# EAGLE design Grove-Barometer (High-Accuracy) v1.0 (EAGLE 6.4)
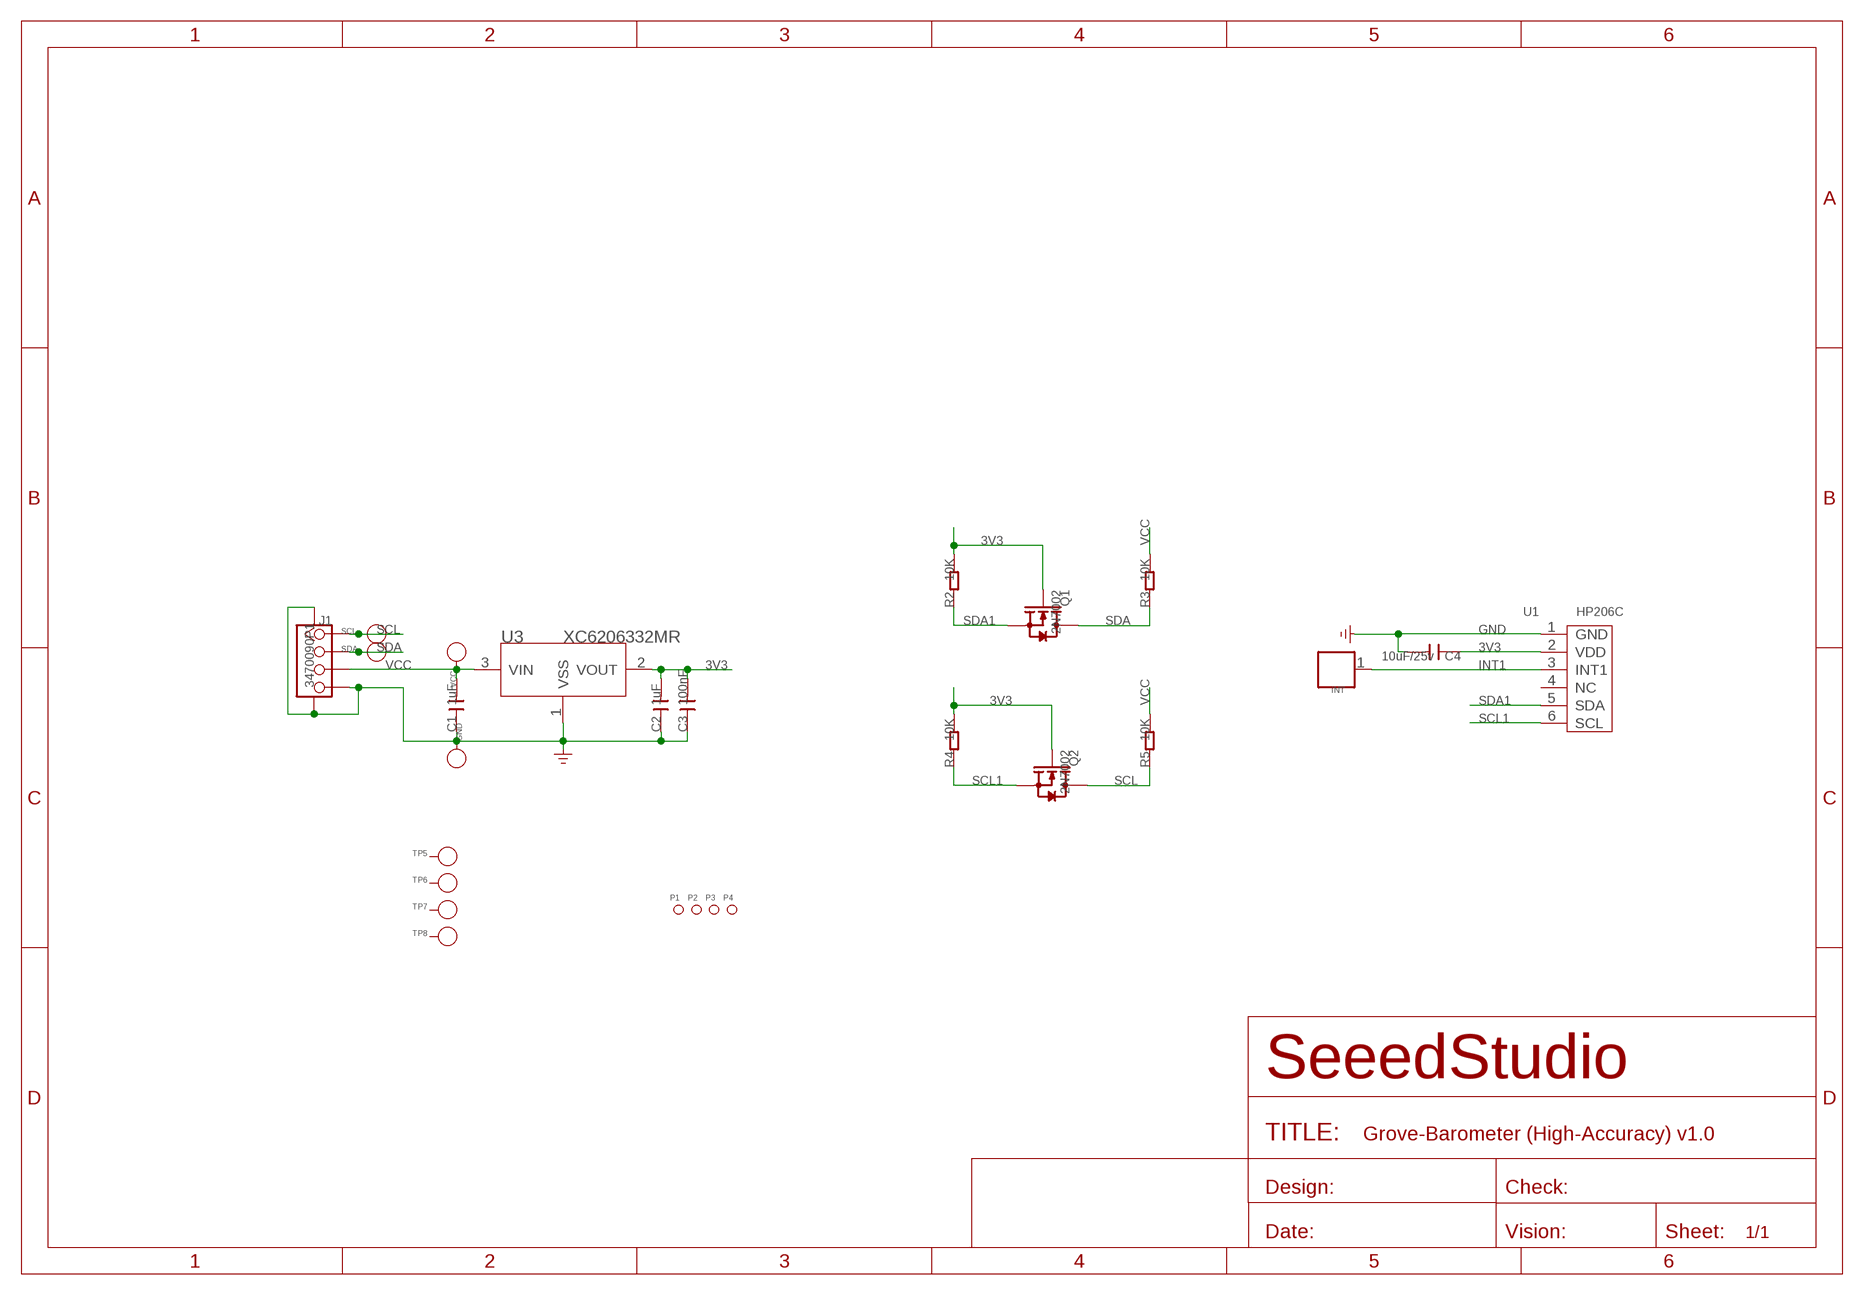
[diagram p0: schematic, sheet 1]

## Parts
C1  1uF  C-0603  [C0603]
C2  1uF  C-0603  [C0603]
C3  100nF  C-0603  [C0603]
C4  10uF/25v  C-0805  [C0805]
GND  PAD-TEST-POINT'4545'  [TP_4545]
INT  PAD'60/30'  [1P-65/35MIL]
J1  3470090P1  TWIG-4P-2.0-SMD-FEMALE-REINFORCE'DD'  [4P-SMD-2.0]
P1  PAD-MARK  [ROUND-MARK-1.0]
P2  PAD-MARK  [ROUND-MARK-1.0]
P3  PAD-MARK  [ROUND-MARK-1.0]
P4  PAD-MARK  [ROUND-MARK-1.0]
Q1  2N7002  MOSFET-N'SOT23'  [SOT23]
Q2  2N7002  MOSFET-N'SOT23'  [SOT23]
R2  10K  R-0603  [R0603]
R3  10K  R-0603  [R0603]
R4  10K  R-0603  [R0603]
R5  10K  R-0603  [R0603]
SCL  PAD-TEST-POINT'4545'  [TP_4545]
SDA  PAD-TEST-POINT'4545'  [TP_4545]
TP5  PAD-TEST-POINT'4545'  [TP_4545]
TP6  PAD-TEST-POINT'4545'  [TP_4545]
TP7  PAD-TEST-POINT'4545'  [TP_4545]
TP8  PAD-TEST-POINT'4545'  [TP_4545]
U1  HP206C  [6P-SMD-6.8X6.2]
U3  XC6206332MR  XC6206MR  [SOT23]
VCC  PAD-TEST-POINT'4545'  [TP_4545]

## Nets
3V3: C2.2 C3.2 C4.1 Q1.1(G) Q2.1(G) R2.2 R4.2 U1.2(VDD) U3.2(VOUT)
GND: C1.1 C2.1 C3.1 C4.2 GND.T J1.4 J1.SS1 J1.SS2 U1.1(GND) U3.1(VSS)
INT1: INT.1 U1.3(INT1)
SCL: J1.1 Q2.3(D) R5.1 SCL.T
SCL1: Q2.2(S) R4.1 U1.6(SCL)
SDA: J1.2 Q1.3(D) R3.1 SDA.T
SDA1: Q1.2(S) R2.1 U1.5(SDA)
VCC: C1.2 J1.3 R3.2 R5.2 U3.3(VIN) VCC.T
Unconnected: TP5.T TP6.T TP7.T TP8.T U1.4(NC)

## Library data of the parts
C1-C4 = Discrete:C*: Ceramic Capacitors
GND SCL SDA TP5-TP8 VCC = Discrete:PAD-TEST-POINT; PARTNO: DNP
INT = Discrete:PAD
J1 = Connector :TWIG-4P-2.0-SMD-FEMALE-REINFORCE
P1-P4 = Discrete:PAD-MARK; PARTNO: DNP
Q1 Q2 = Discrete:MOSFET-N: IRLL014: http://www.vishay.com/docs/91319/sihll014.pdf
R2-R5 = Discrete:R*
U1 = template :HP206C: I2C PRECISION BAROMETER AND ALTIMETER
U3 = IC:XC6206: LOW ESR Cap.Compatible Positive Voltage Regulators

## Board
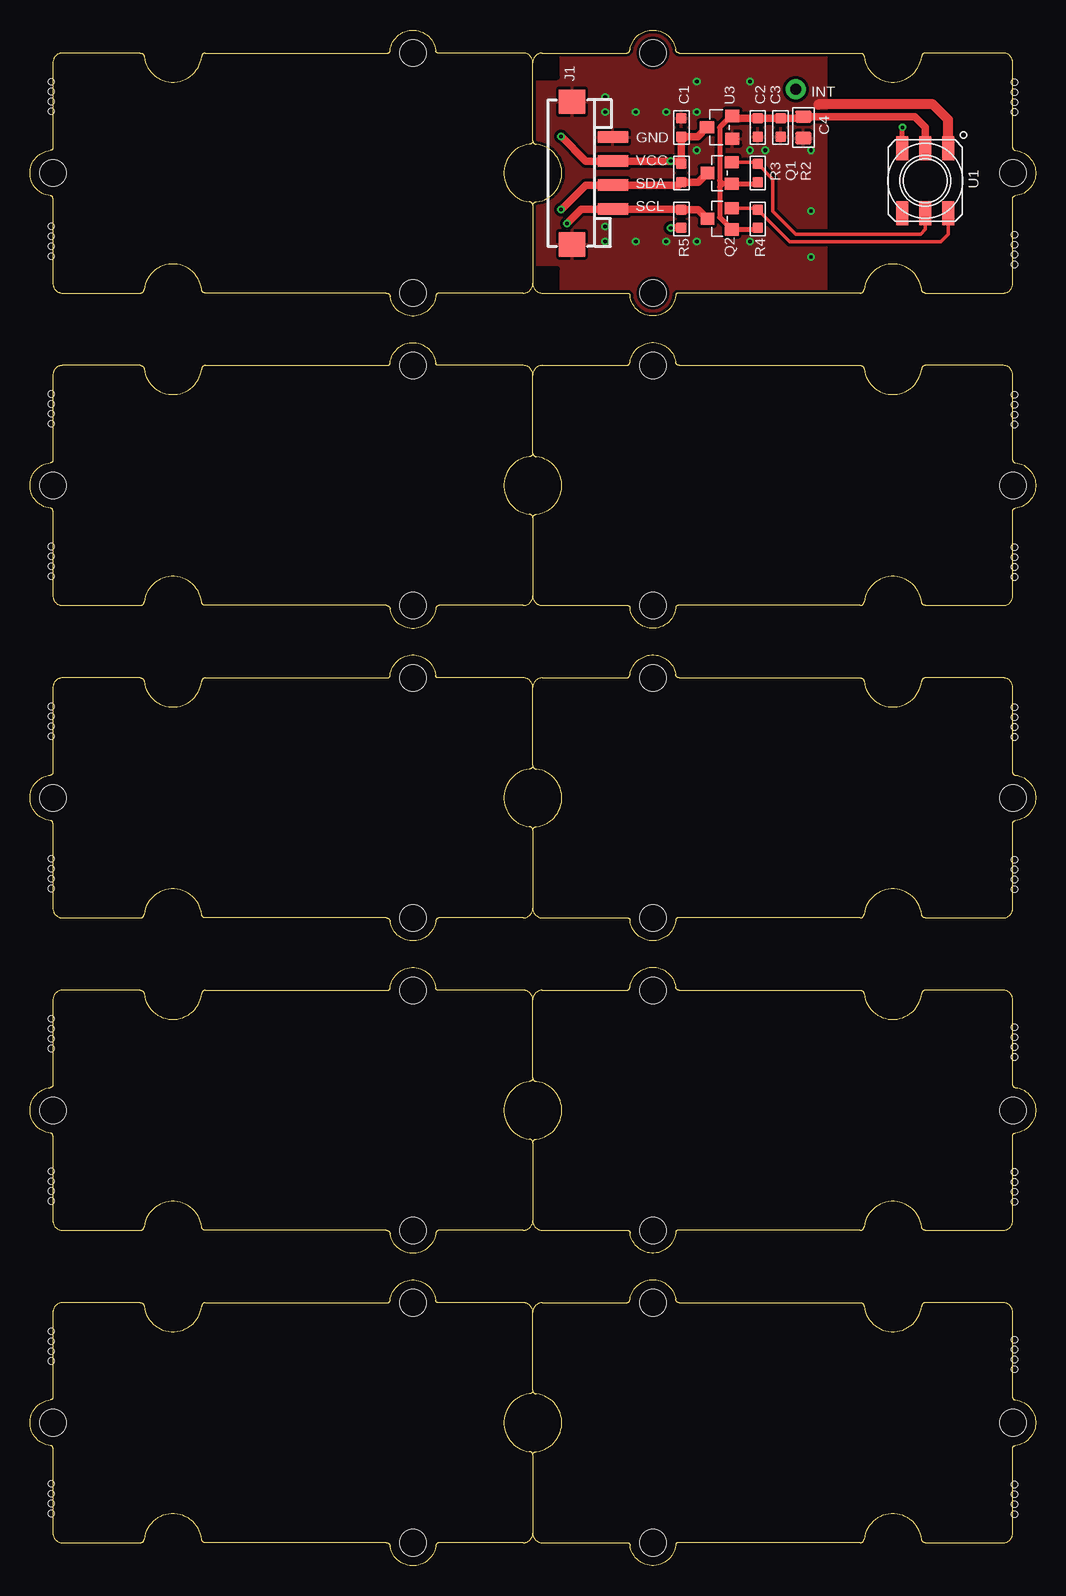
[diagram p1: board, top side]
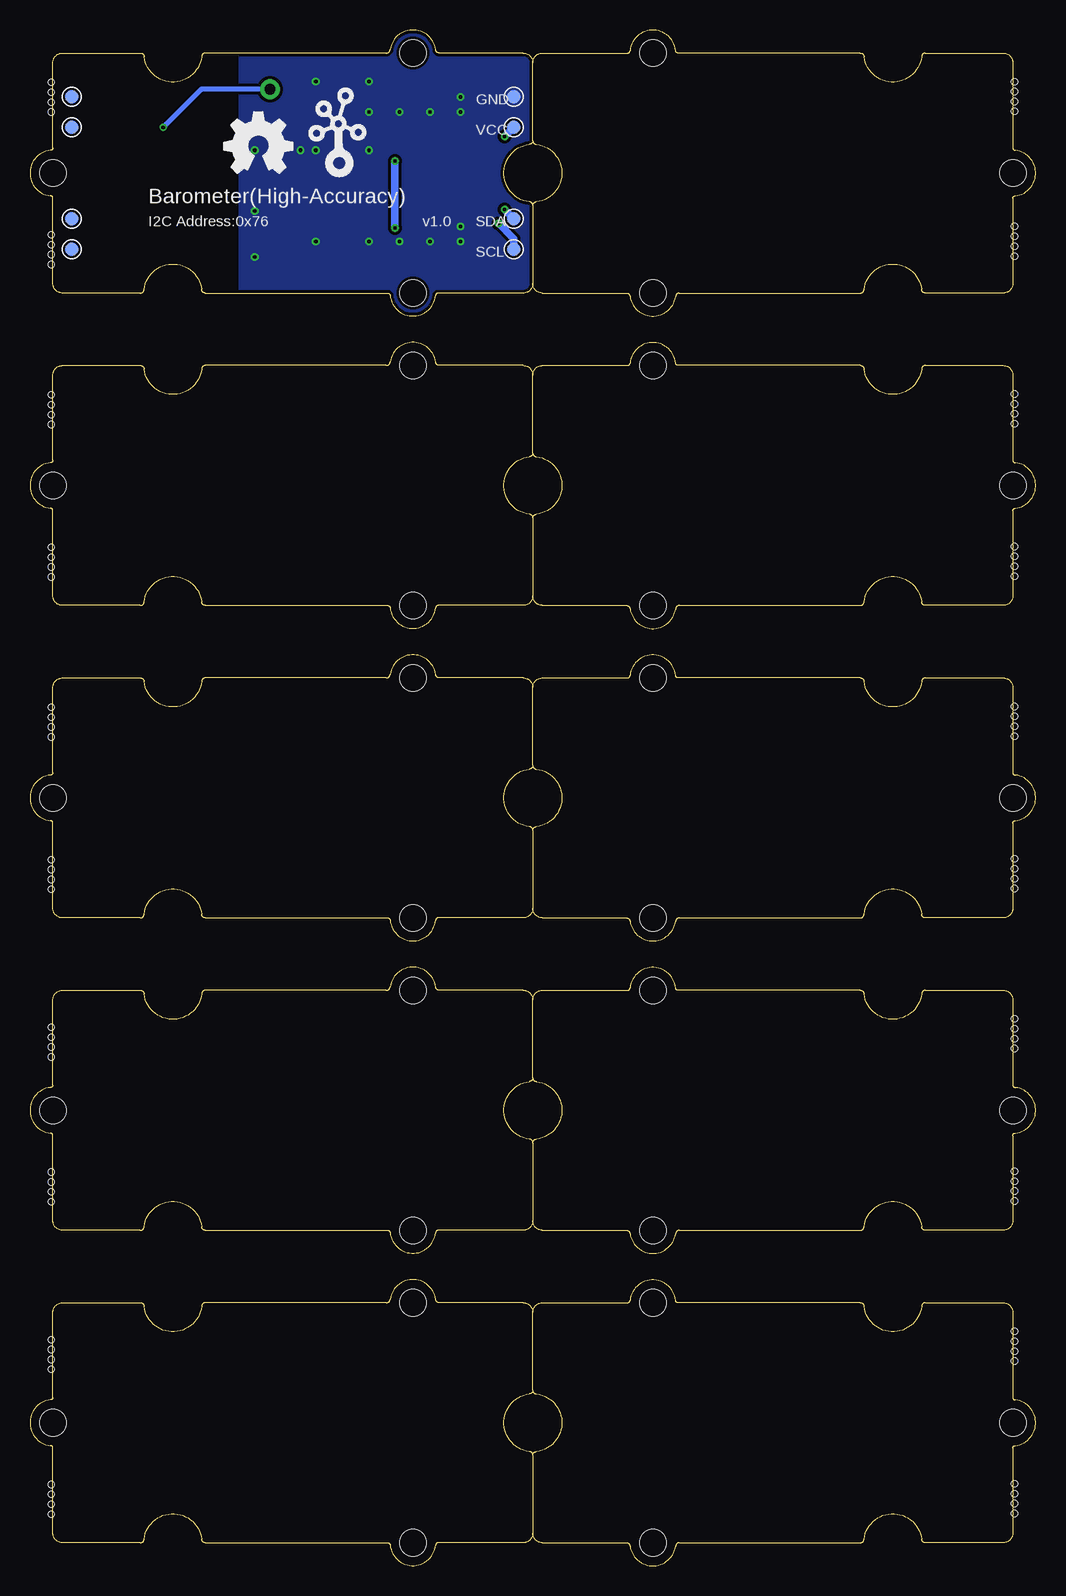
[diagram p2: board, bottom side, seen from below]

Size 83.81 x 127.98 mm. Coordinates in mm from the lower left corner, seen from the top.
Copper layers (1*16): Top 0.035mm / dielectric 1.5mm / Bottom 0.035mm
Design rules "SeeedStudio_2layer_DRU_no_angle_20140221 *": minimum track width 6mil, minimum drill 12mil, track to track 6mil, track to pad 6mil, pad to pad 6mil, via to via 6mil, smd to smd 0mil, copper to edge 10mil, drill to drill 10mil, minimum pad ring 10mil, minimum via ring 6mil, stop-mask expansion 2mil, vias tented up to drill 100mil, thermal gap 10mil
Holes 0.5 mm at 1.77,32.88 1.77,30.4 1.77,31.23 1.77,32.05 1.77,45.58 1.77,43.1 1.77,43.93 1.77,44.75 1.77,58.91 1.77,56.43 1.77,57.26 1.77,58.09 1.77,71.61 1.77,69.13 1.77,69.96 1.77,70.79 1.77,84.95 1.77,82.47 1.77,83.3 1.77,84.12 1.77,97.65 1.77,95.17 1.77,96 1.77,96.82 1.77,111.62 1.77,109.14 1.77,109.97 1.77,110.79 1.77,123.68 1.77,121.2 1.77,122.03 1.77,122.86 82.04,121.14 82.04,123.62 82.04,122.79 82.04,121.97 82.04,108.44 82.04,110.92 82.04,110.09 82.04,109.27 82.04,95.11 82.04,97.58 82.04,96.76 82.04,95.93 82.04,82.41 82.04,84.88 82.04,84.06 82.04,83.23 82.04,69.07 82.04,71.55 82.04,70.72 82.04,69.9 82.04,56.37 82.04,58.85 82.04,58.02 82.04,57.2 82.04,42.4 82.04,44.88 82.04,44.05 82.04,43.23 82.04,30.34 82.04,32.81 82.04,31.99 82.04,31.16 1.77,6.84 1.77,4.36 1.77,5.19 1.77,6.02 1.77,19.54 1.77,17.06 1.77,17.89 1.77,18.72 82.04,16.37 82.04,18.84 82.04,18.02 82.04,17.19 82.04,4.3 82.04,6.78 82.04,5.95 82.04,5.13
Holes 1.91 mm at -4.13,2.4 87.94,2.4 87.94,125.59 -4.13,125.59

### Footprints (pad centres in the part's own frame; a part is rotated, then mirrored left to right if it is on the bottom)
C0603 = smd 0.889 x 0.889: 1 -0.762,0; 2 0.762,0
C0805 = smd 1.016 x 1.397: 1 -0.889,0; 2 0.889,0
TP_4545 = smd 1.143 x 1.143: T 0,0
1P-65/35MIL = drill 0.889 pad 1.651: 1 0,0
4P-SMD-2.0 = smd 0.965 x 2.54: 1 -3,0; 2 -1,0; 3 1,0; 4 3,0 | smd 2.032 x 2.184: SS1 -5.946,3.4; SS2 5.946,3.4
ROUND-MARK-1.0 = smd 1.016 x 1.016: P$1 0,0
SOT23 = smd 1.016 x 1.143: 1 -0.889,-1.016; 2 0.889,-1.016; 3 0,1.016
R0603 = smd 0.889 x 0.889: 1 -0.762,0; 2 0.762,0
6P-SMD-6.8X6.2 = smd 2 x 1: 1 -2.7,1.9; 2 -2.7,0; 3 -2.7,-1.9; 4 2.7,-1.9; 5 2.7,0; 6 2.7,1.9
SOT23' = smd 1.016 x 1.2: 1 -0.95,-1.06; 2 0.95,-1.06; 3 0,1.06
GROVE-2CONNECTOR-SMD = hole 2.2: -10,-10; -10,10; 20,0

### Placement (x,y rotation side)
C1  54.29,119.87 270 top
C2  60.64,119.87 90 top
C3  62.54,119.87 90 top
C4  64.45,119.87 270 top
GND  43.5,122.41 0 bottom
INT  63.81,123.05 0 top
J1  48.57,116.06 90 top
P1  -4.13,7.48 0 top  (outside the outline)
P2  87.94,7.48 0 top  (outside the outline)
P3  -4.13,120.51 0 top  (outside the outline)
P4  87.94,120.51 0 top  (outside the outline)
Q1  57.46,116.06 90 top
Q2  57.46,112.25 90 top
R2  60.64,116.06 270 top
R3  54.29,116.06 90 top
R4  60.64,112.25 270 top
R5  54.29,112.25 270 top
SCL  43.49,109.71 0 bottom
SDA  43.49,112.25 90 bottom
TP5  80.32,122.41 0 bottom
TP6  80.32,119.87 0 bottom
TP7  80.32,112.25 0 bottom
TP8  80.32,109.71 0 bottom
U1  74.61,115.43 270 top
U3  XC6206332MR  [SOT23']  57.46,119.87 90 top
U$4  [GROVE-2CONNECTOR-SMD]  21.91,116.06 180 top
U$5  [GROVE-2CONNECTOR-SMD]  61.9,116.06 0 top
U$6  [OSHW_FILLX200_NOTEXT]  67.62,116.06 0 bottom
U$7  [TWIGLOGO]  58.09,116.7 0 bottom
U$8  [GROVE-2CONNECTOR-SMD]  21.91,90.03 180 top
U$9  [GROVE-2CONNECTOR-SMD]  61.9,90.03 0 top
U$10  [GROVE-2CONNECTOR-SMD]  21.91,63.99 180 top
U$11  [GROVE-2CONNECTOR-SMD]  61.9,63.99 0 top
U$12  [GROVE-2CONNECTOR-SMD]  21.91,37.96 180 top
U$13  [GROVE-2CONNECTOR-SMD]  61.9,37.96 0 top
U$14  [GROVE-2CONNECTOR-SMD]  21.91,11.92 180 top
U$15  [GROVE-2CONNECTOR-SMD]  61.9,11.92 0 top
VCC  43.49,119.87 0 bottom

### Tracks (layer width: path | path; a pad name or v marks a point on that pad's centre or on a via)
3V3
  Top 0.406: C2.2 58.22,120.63 57.46,119.87 57.46,115.43 | 57.46,115.43 57.46,114.92 | 57.46,114.92 57.46,112.38 Q2.1 60.64,111.36 R4.2 | 57.72,115.17 57.46,115.43 | 57.72,115.17 Q1.1 60.64,115.17 R2.2 | 57.72,115.17 57.46,114.92
  Top 0.61: U3.2 58.71,120.63 C2.2 C3.2 | C3.2 62.03,120.63 61.91,120.63 | C3.2 64.32,120.63 C4.1 73.72,120.76 74.61,119.87 U1.2
GND  (via drill 0.3 pad 0.64)
  Top 0.813: U1.1 76.51,120.51 75.24,121.78 65.72,121.78
  other vias: 60,117.97 61.27,117.97 53.02,121.14 65.08,117.97 55.56,117.97 53.02,110.35 47.94,121.14 50.48,121.14 55.56,121.14 47.94,122.41 47.94,110.35 47.94,111.62 55.56,110.35 60,110.35 65.08,112.89 50.48,110.35 55.56,123.68 60,123.68 65.08,109.08
  pour Top (isolate 0.254): 41.58,128.13 66.35,128.13 66.35,104 41.58,104
  pour Bottom (isolate 0.254): 41.58,128.13 66.35,128.13 66.35,104 41.58,104
INT1  (via drill 0.3)
  Top 0.406: U1.3 v72.71,119.87 v72.7,119.87
  Bottom 0.406: INT.1 69.53,123.05 v72.7,119.87
SCL  (via drill 0.3)
  Top 0.61: v44.76,111.87 45.95,113.06 J1.1 54.24,113.06 R5.1 55.68,113.01 Q2.3
  Bottom 0.61: v44.76,111.87 43.49,110.6 SCL.T
SCL1
  Top 0.305: Q2.2 60.51,113.14 R4.1 63.3,110.35 75.88,110.35 76.51,110.98 U1.6
SDA  (via drill 0.3)
  Top 0.61: v44.25,113.01 46.3,115.06 J1.2 54.05,115.06 R3.1 55.68,115.3 Q1.3
  Bottom 0.61: v44.25,113.01 SDA.T
SDA1
  Top 0.305: Q1.2 60.51,116.95 R2.1 61.91,115.55 61.91,112.89 63.81,110.98 74.23,110.98 74.61,111.36 U1.5
VCC  (via drill 0.3, 0.3 pad 0.64)
  Top 0.61: R5.2 v53.4,111.49 | v44.25,119.11 46.3,117.06 J1.3 v53.4,117.06 54.05,117.06 R3.2 C1.2 55.64,119.1 U3.3
  Bottom 0.61: v53.4,111.49 v53.4,117.06 | v44.25,119.11 VCC.T

### Text on the board
tPlace: GND | VCC | SDA | SCL
bPlace: Barometer(High-Accuracy) | I2C Address:0x76
tNames: INT
bNames: v1.0